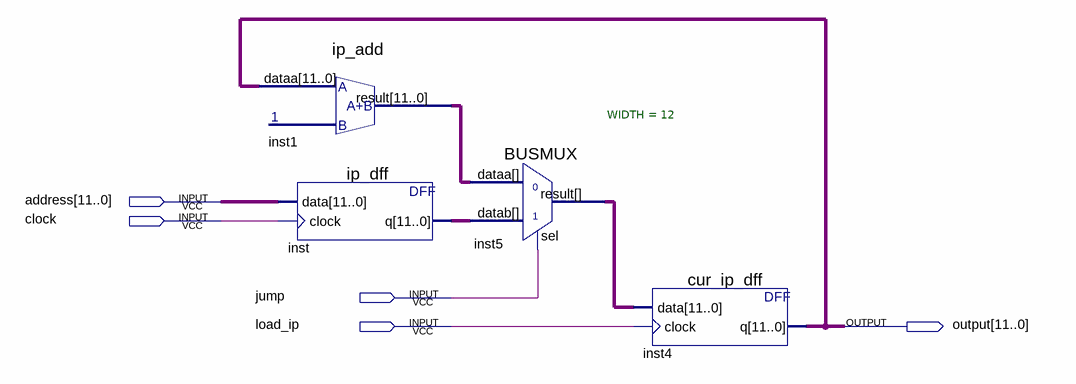
[diagram p0: schematic sheet]
// Quartus schematic IP.bdf as structural Verilog: 4 symbols, 5 pins
module IP (
  input  [11:0] address,
  input  clock,
  input  jump,
  input  load_ip,
  output [11:0] \output 
);

  wire [11:0] inst1_result, inst5_result, inst_q;

  ip_add inst1 (.dataa(\output ), .result(inst1_result));
  ip_dff inst (.data(address), .clock(clock), .q(inst_q));
  BUSMUX #(.WIDTH(12)) inst5 (.datab(inst_q), .sel(jump), .dataa(inst1_result), .result(inst5_result));
  cur_ip_dff inst4 (.data(inst5_result), .clock(load_ip), .q(\output ));
endmodule
